# EAGLE design chicken-shield (EAGLE 8.2.1)
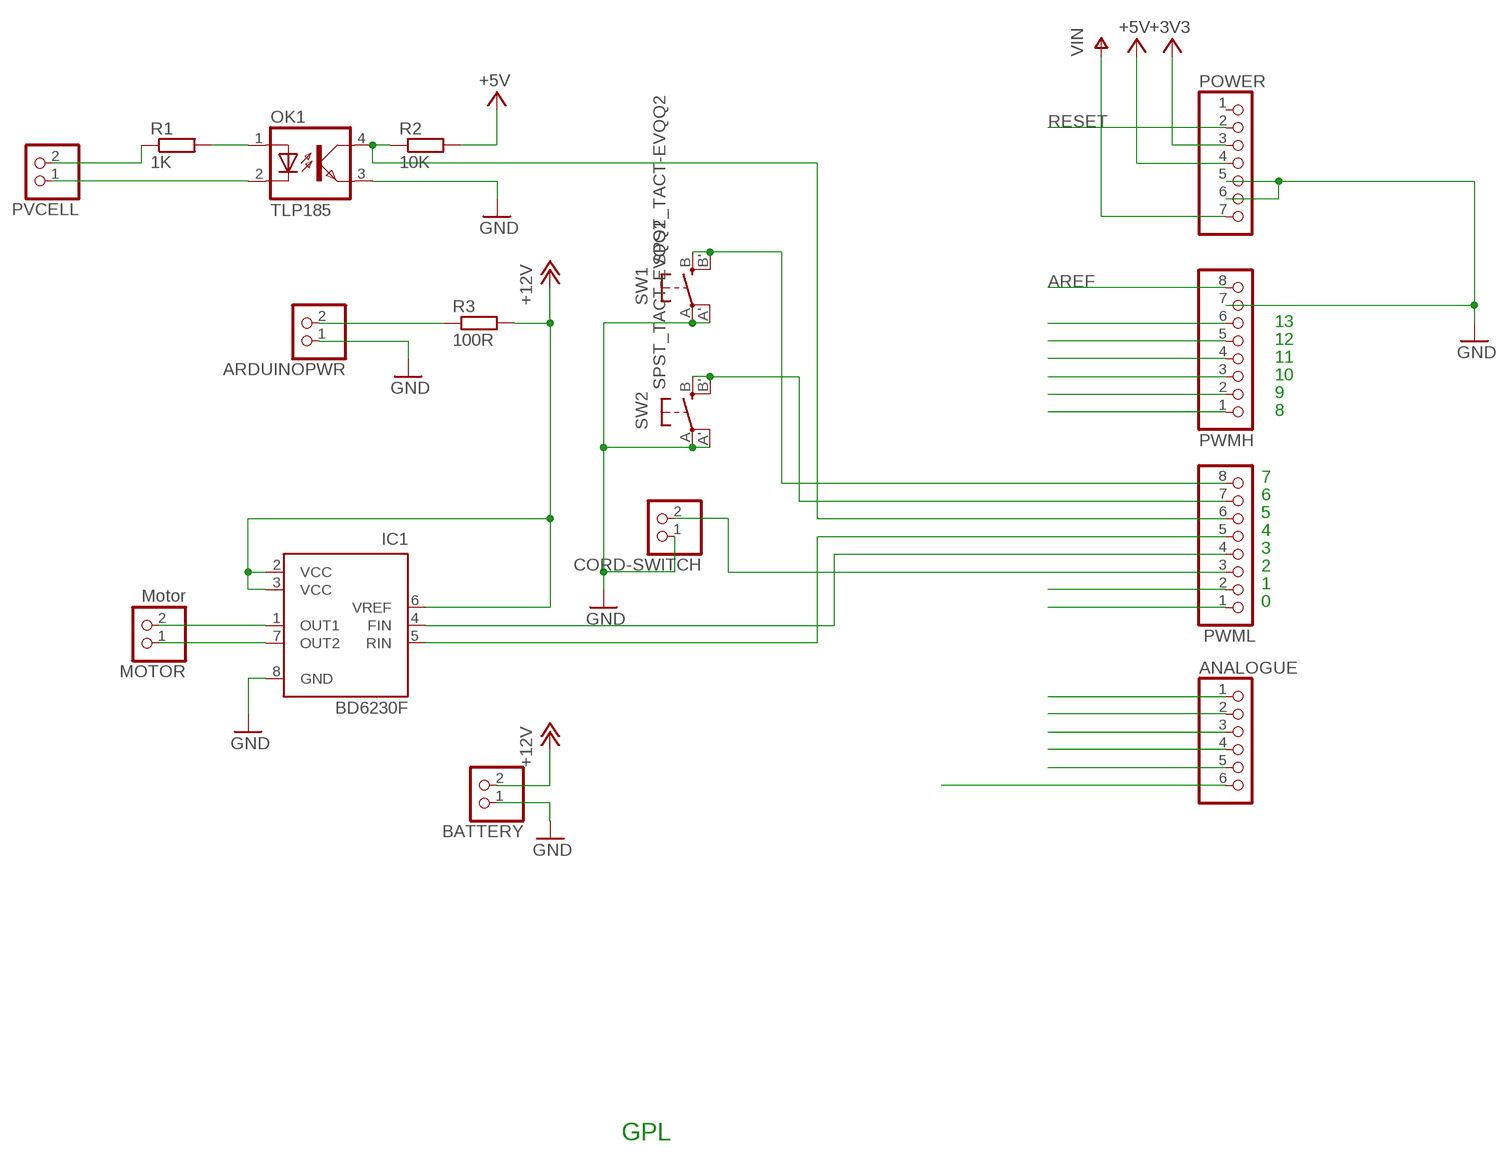
[diagram p0: schematic, sheet 1]

## Parts
ANALOGUE  PINHD-1X6  [1X06]
ARDUINOPWR  PINHD-1X2  [1X02]
BATTERY  PINHD-1X2  [1X02]
CORD-SWITCH  PINHD-1X2  [1X02]
IC1  BD6230F  [SOP8]
MOTOR  Motor  PINHD-1X2  [1X02]
OK1  TLP185  TLP283  [MINI-FLAT-4]
POWER  PINHD-1X7  [1X07]
PVCELL  PINHD-1X2  [1X02]
PWMH  PINHD-1X8  [1X08]
PWML  PINHD-1X8  [1X08]
R1  1K  R-EU_M0805  [M0805]
R2  10K  R-EU_M0805  [M0805]
R3  100R  R-EU_0204/7  [0204/7]
SW1  SPST_TACT-EVQQ2  [EVQ-Q2]
SW2  SPST_TACT-EVQQ2  [EVQ-Q2]

## Nets
+3V3 [power]: POWER.3
+5V [usbvcc]: POWER.4 R2.2
+12V: BATTERY.2 IC1.2(VCC) IC1.3(VCC) IC1.6(VREF) R3.2
A0: ANALOGUE.1
A1: ANALOGUE.2
A2: ANALOGUE.3
A3: ANALOGUE.4
A4: ANALOGUE.5
A5: ANALOGUE.6
AREF: PWMH.8
DIG0_RX: PWML.1
DIG1_TX: PWML.2
DIG2: IC1.5(RIN) PWML.5
DIG3: IC1.4(FIN) PWML.4
DIG4: CORD-SWITCH.2 PWML.3
DIG8: PWMH.1
DIG9: PWMH.2
DIG10: PWMH.3
DIG11: PWMH.4
DIG12: PWMH.5
DIG13: PWMH.6
GND [gnd]: ARDUINOPWR.1 BATTERY.1 CORD-SWITCH.1 IC1.8(GND) OK1.3(EMIT) POWER.5 POWER.6 PWMH.7 SW1.A'(P1) SW1.A(P) SW2.A'(P1) SW2.A(P)
N$1: OK1.2(C) PVCELL.1
N$2: OK1.1(A) R1.2
N$3: IC1.1(OUT1) MOTOR.2
N$4: ARDUINOPWR.2 R3.1
N$5: IC1.7(OUT2) MOTOR.1
N$6: PVCELL.2 R1.1
N$7: OK1.4(COL) PWML.6 R2.1
N$8: PWML.8 SW1.B'(S1) SW1.B(S)
N$9: PWML.7 SW2.B'(S1) SW2.B(S)
RESET: POWER.2
VIN: POWER.7
Unconnected: POWER.1

## Notes on the sheet
- 13
- 12
- 11
- 10
- 9
- 8
- 7
- 6
- 5
- 4
- 3
- 2
- 1
- 0
- GPL

## Library data of the parts
ANALOGUE = pinhead - big pad:PINHD-1X6: PIN HEADER
ARDUINOPWR BATTERY CORD-SWITCH MOTOR PVCELL = pinhead:PINHD-1X2: PIN HEADER
IC1 = rohm:BD623*F: H-bridge driver for brush motors Source: http://www.rohm.com/products/databook/motor/pdf/bd623x_series-e.pdf; MPN: BD6230F-E2; OC_FARNELL: 1716264; OC_NEWARK: 15R0529
OK1 = opto:TLP283: TOSHIBA PHOTOCOUPLER GaAs IRED & PHOTO-TRANSISTOR Source: http://www.semicon.toshiba.co.jp/td/en/Opto/Photocoupler/en_20050928_TLP283_datasheet.pdf; OC_FARNELL: unknown; OC_NEWARK: unknown
POWER = pinhead - big pad:PINHD-1X7: PIN HEADER
PWMH PWML = pinhead:PINHD-1X8: PIN HEADER
R1-R3 = rcl:R-EU_: RESISTOR, European symbol
SW1 SW2 = adafruit:SPST_TACT: SMT 6mm switch, EVQQ2 series http://www.ladyada.net/library/eagle

## Net classes
0 default: width 0.203 mm, drill 0.406 mm, clearance 0.203 mm
1 power: width 0.61 mm, drill 0.711 mm, clearance 0.203 mm
2 gnd: width 0.305 mm, drill 0.711 mm, clearance 0.203 mm
3 usbvcc: width 0.508 mm, drill 0.711 mm, clearance 0.203 mm

## Board
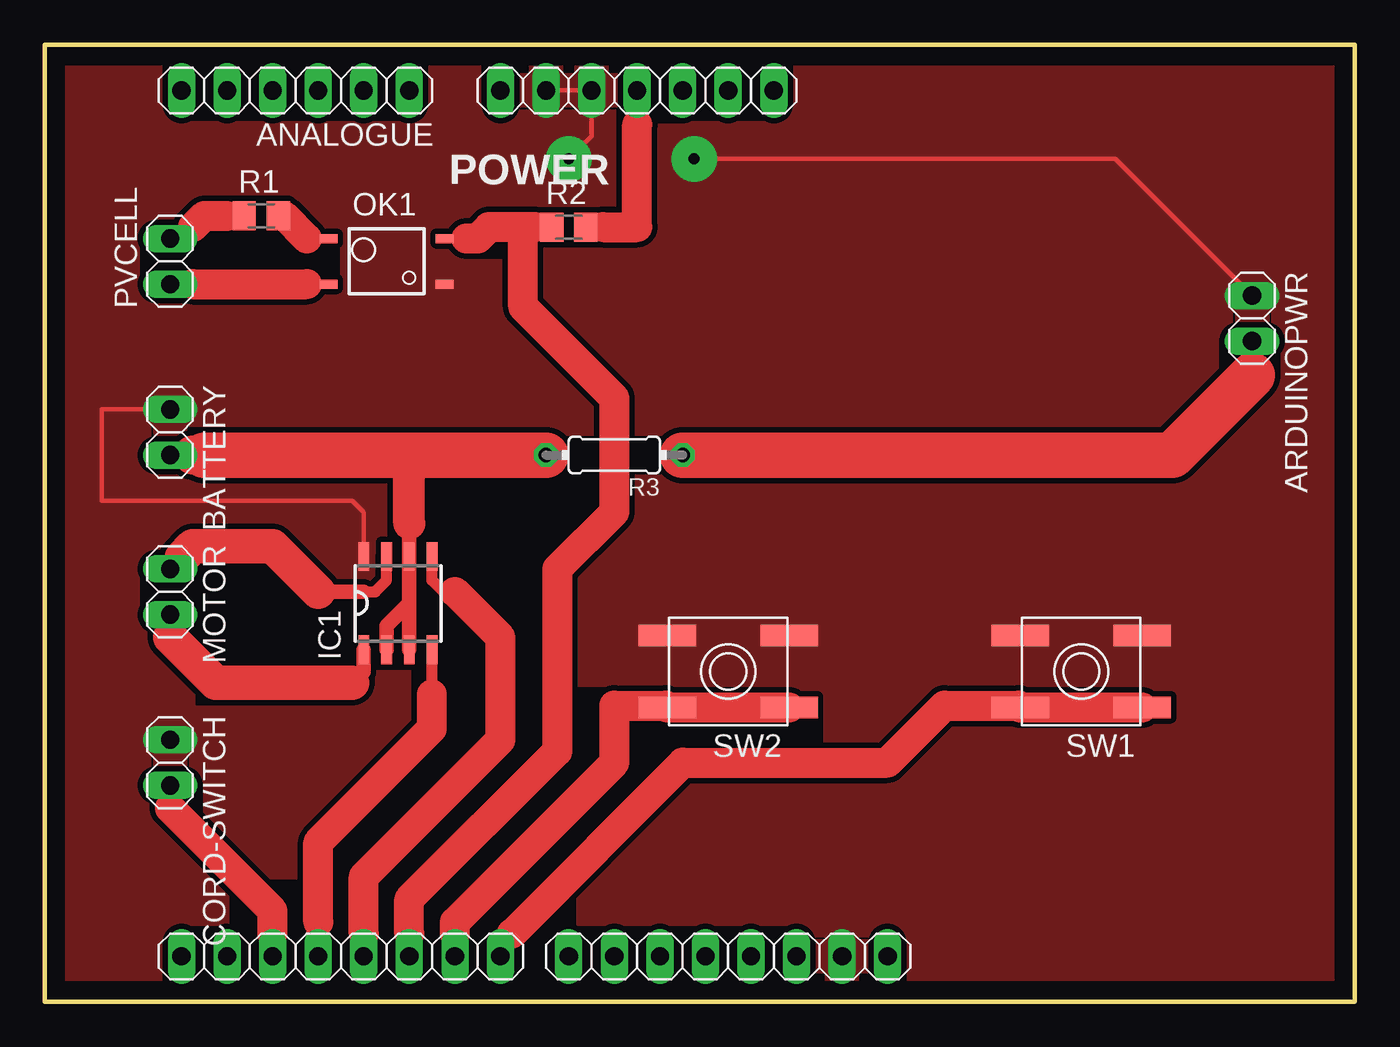
[diagram p1: board, top side]
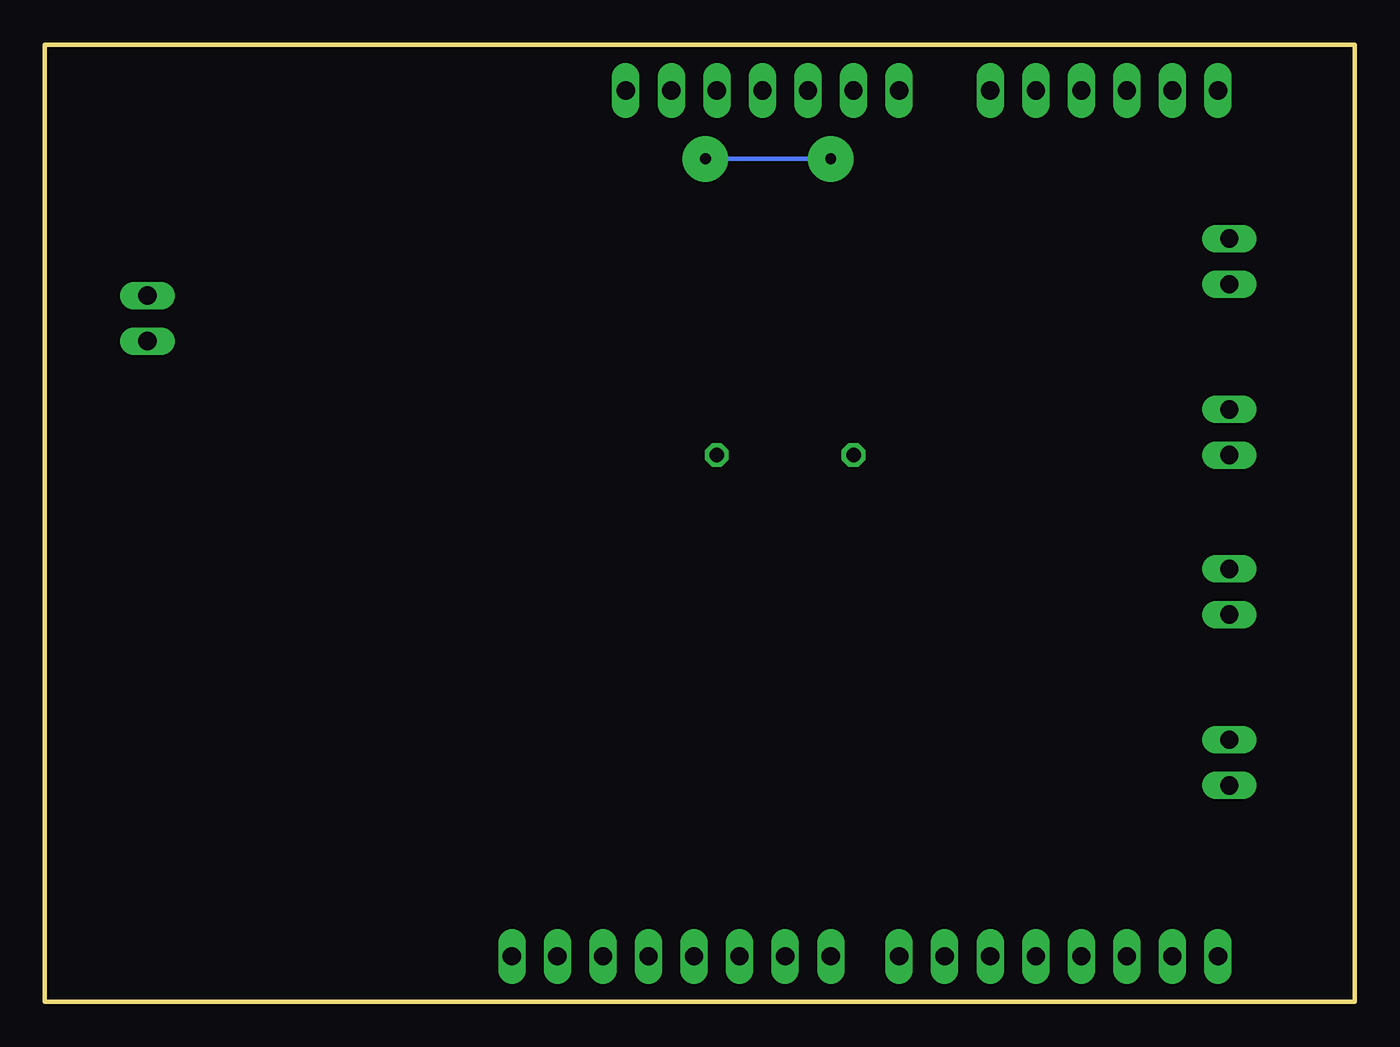
[diagram p2: board, bottom side, seen from below]

Size 73.02 x 53.34 mm. Coordinates in mm from the lower left corner, seen from the top.
Outline: 73.02,0 0,0 0,53.34 73.02,53.34 73.02,0
Copper layers (1*16): Top 0.035mm / dielectric 1.5mm / Bottom 0.035mm
Design rules "default *": minimum track width 8mil, minimum drill 16mil, track to track 12mil, track to pad 12mil, pad to pad 12mil, via to via 10mil, smd to smd 8mil, copper to edge 40mil, drill to drill 12mil, minimum pad ring 10mil, minimum via ring 10mil, stop-mask expansion 4mil, vias tented up to drill 0mil, thermal gap 10mil

### Footprints (pad centres in the part's own frame; a part is rotated, then mirrored left to right if it is on the bottom)
1X06 = drill 1.016 long: 1 -6.35,0; 2 -3.81,0; 3 -1.27,0; 4 1.27,0; 5 3.81,0; 6 6.35,0
1X02 = drill 1.016 long: 1 -1.27,0; 2 1.27,0
SOP8 = smd 0.6 x 1.6: 1 -1.905,-2.6; 2 -0.635,-2.6; 3 0.635,-2.6; 4 1.905,-2.6; 5 1.905,2.6; 6 0.635,2.6; 7 -0.635,2.6; 8 -1.905,2.6
MINI-FLAT-4 = smd 1 x 0.5: 1 -3.24,0.635; 2 -3.24,-1.905; 3 3.24,-1.905; 4 3.24,0.635
1X07 = drill 1.016 long: 1 -7.62,0; 2 -5.08,0; 3 -2.54,0; 4 0,0; 5 2.54,0; 6 5.08,0; 7 7.62,0
1X08 = drill 1.016 long: 1 -8.89,0; 2 -6.35,0; 3 -3.81,0; 4 -1.27,0; 5 1.27,0; 6 3.81,0; 7 6.35,0; 8 8.89,0
M0805 = smd 1.3 x 1.6: 1 -0.95,0; 2 0.95,0
0204/7 = drill 0.813 octagon: 1 -3.81,0; 2 3.81,0
EVQ-Q2 = smd 3.2 x 1.2: A -3.4,-2; A' 3.4,-2; B -3.4,2; B' 3.4,2

### Placement (x,y rotation side)
ANALOGUE  13.97,50.8 180 top
ARDUINOPWR  67.31,38.1 270 top
BATTERY  6.99,31.75 270 top
CORD-SWITCH  6.99,13.34 270 top
IC1  19.68,22.22 0 top
MOTOR  6.99,22.86 270 top
OK1  19.05,41.91 0 top
POWER  33.02,50.8 180 top
PVCELL  6.99,41.27 90 top
PWMH  38.1,2.54 0 top
PWML  16.51,2.54 0 top
R1  12.06,43.81 0 top
R2  29.21,43.18 0 top
R3  31.75,30.48 180 top
SW1  57.79,18.41 180 top
SW2  38.1,18.41 180 top

### Tracks (layer width: path | path; a pad name or v marks a point on that pad's centre or on a via)
+5V
  Top 0.406: R2.2 31.11,43.18
  Top 1.016: 33.02,48.89 POWER.4
  Top 1.676: 33.02,48.89 33.02,43.18 31.11,43.18
+12V
  Top 0.813: 20.32,26.67 IC1.6 20.32,22.22 | IC1.3 20.32,22.22 | IC1.2 19.05,20.95 20.32,22.22
  Top 1.27: BATTERY.2 8.26,30.48
  Top 1.778: 20.32,26.67 20.32,30.48
  Top 2.184: 8.26,30.48 8.89,30.48
  Top 2.54: 8.89,30.48 20.32,30.48 R3.2
DIG2
  Top 0.61: 22.86,22.86 22.22,22.86 21.59,23.49 IC1.5
  Top 1.27: PWML.5 17.78,3.81
  Top 1.676: 17.78,3.81 17.78,6.99 25.4,14.61 25.4,20.32 22.86,22.86
DIG3
  Top 0.61: 21.59,17.14 IC1.4
  Top 1.27: PWML.4 15.24,4.44
  Top 1.676: 15.24,4.44 15.24,8.89 21.59,15.24 21.59,17.14
DIG4
  Top 0.61: 6.99,10.79 CORD-SWITCH.2
  Top 1.016: PWML.3 12.7,3.81
  Top 1.676: 12.7,3.81 12.7,5.08 6.99,10.79
GND  (via drill 0.6 pad 2.54)
  Top 0.254: POWER.6 POWER.5 30.48,48.26 v29.21,46.99 | v36.2,46.99 59.69,46.99 ARDUINOPWR.1 | IC1.8 17.78,27.3 17.14,27.94 3.17,27.94 3.17,33.02 BATTERY.1
  Bottom 0.254: v29.21,46.99 v36.2,46.99
  pour Top: 1.27,55.24 72.39,55.24 72.39,-1.27 0,-1.27 0,55.24
N$1
  Top 0.254: 14.61,40 OK1.2
  Top 0.813: PVCELL.1 8.26,40
  Top 1.676: 8.26,40 14.61,40
N$2
  Top 0.254: OK1.1 15.24,42.55 | 13.34,43.81 R1.2
  Top 0.406: 15.24,42.55 14.61,42.55
  Top 1.676: 14.61,42.55 13.34,43.81
N$3
  Top 0.813: IC1.1 17.78,18.41 17.14,17.78
  Top 1.016: 6.99,20.32 MOTOR.2
  Top 1.93: 17.14,17.78 9.53,17.78 6.99,20.32
N$4
  Top 1.27: 67.31,34.92 ARDUINOPWR.2
  Top 2.54: R3.1 62.87,30.48 67.31,34.92
N$5
  Top 0.61: 17.78,22.86 18.41,22.86 19.05,23.49 IC1.7
  Top 0.813: 15.24,22.86 17.78,22.86
  Top 1.27: 7.62,24.77 MOTOR.1
  Top 1.93: 15.24,22.86 12.7,25.4 8.26,25.4 7.62,24.77
N$6
  Top 0.254: 10.16,43.81 R1.1
  Top 1.016: PVCELL.2 7.62,42.55 8.26,43.18
  Top 1.676: 8.26,43.18 8.89,43.81 10.16,43.81
N$7
  Top 0.254: 23.49,42.55 OK1.4
  Top 0.406: R2.1 27.3,43.18
  Top 1.016: PWML.6 20.32,3.81
  Top 1.676: 20.32,3.81 20.32,5.71 28.57,13.97 28.57,24.13 31.75,27.3 31.75,33.66 26.67,38.73 26.67,43.18 | 27.3,43.18 26.67,43.18 | 26.67,43.18 24.76,43.18 24.13,42.55 23.49,42.55
N$8
  Top 1.016: PWML.8 25.4,3.17 26.04,3.81
  Top 1.676: SW1.B SW1.B' 54.29,16.51 50.16,16.51 46.99,13.34 35.56,13.34 26.04,3.81
N$9
  Top 1.016: PWML.7 22.86,3.81
  Top 1.676: 22.86,3.81 22.86,4.44 31.75,13.34 31.75,16.51 34.61,16.51 SW2.B' SW2.B